# Altium schematic sheet motor.SchDoc
size A
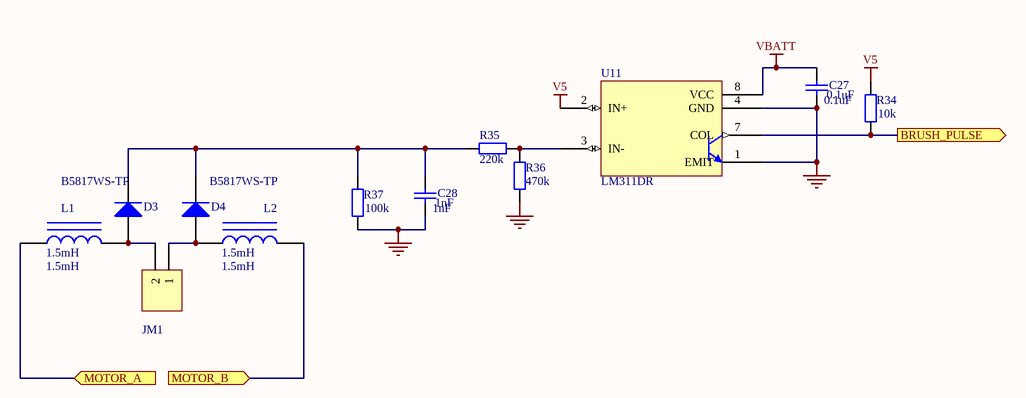
[diagram p0: motor.SchDoc]

## Parts
C27  0.1uF  [CAPC2012L]
C28  1nF  [CAPC1608L]
D3  B5817WS-TP  [SOD_323]
D4  B5817WS-TP  [SOD_323]
JM1  (no value)  [HDR1X2H]
L1  1.5mH  [InductorThruHole]
L2  1.5mH  [InductorThruHole]
R34  10k  [RESC1608L]
R35  220k  [RESC1608L]
R36  470k  [RESC1608L]
R37  100k  [RESC1608L]
U11  LM311DR  [LM311DR]

## Ports
BRUSH_PULSE (out), MOTOR_A (in), MOTOR_B (in)

## Nets
GND: C27.2 C28.2 R36.1 R37.2 U11.1(EMIT) U11.4(GND)
V5: R34.1 U11.2(IN+)
VBATT: C27.1 U11.8(VCC)
BRUSH_PULSE: R34.2 U11.7(COL) ; port BRUSH_PULSE
MOTOR_A: L1.1 ; port MOTOR_A
MOTOR_B: L2.2 ; port MOTOR_B
NetC28_1: C28.1 D3.2 D4.2 R35.1 R37.1
NetD3_1: D3.1 JM1.2 L1.2
NetD4_1: D4.1 JM1.1 L2.1
NetR35_2: R35.2 R36.2 U11.3(IN-)

## Library data of the parts
C27 C28 = Cap: Capacitor; Published: 8-Jun-2000; LatestRevisionDate: 17-Jul-2002; LatestRevisionNote: Re-released for DXP Platform.; PackageReference: RAD-0.3; Publisher: Altium Limited; PackageDescription: Radial Cap, Thru-Hole; 2 Leads; 0.3 in Pin Spacing
  C27: Value: 0.1uF
  C28: Value: 1nF
JM1 = Header 2: Header, 2-Pin; LatestRevisionDate: 17-Jul-2002; LatestRevisionNote: Re-released for DXP Platform.; Publisher: Altium Limited
L1 L2 = Inductor Iron: Magnetic-Core Inductor; Published: 24-Mar-1999; LatestRevisionDate: 17-Jul-2002; LatestRevisionNote: Re-released for DXP Platform.; PackageReference: AXIAL-0.9; Publisher: Altium Limited; Value: 1.5mH
R34-R37 = Res2: Resistor; Published: 8-Jun-2000; LatestRevisionDate: 17-Jul-2002; LatestRevisionNote: Re-released for DXP Platform.; PackageReference: AXIAL-0.4; Publisher: Altium Limited
  R34: Value: 10k
  R35: Value: 220k
  R36: Value: 470k
  R37: Value: 100k